# Altium schematic sheet LEDs.SchDoc
size A
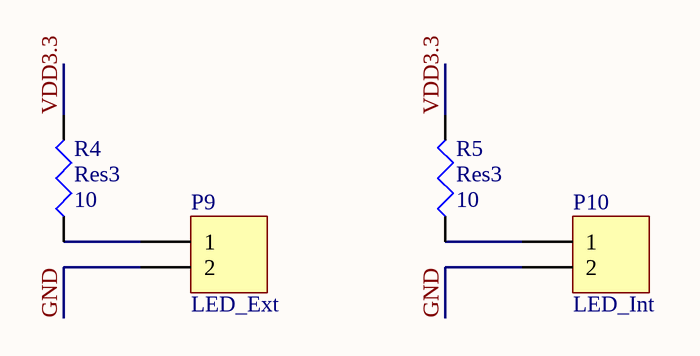
[diagram p0: LEDs.SchDoc]

## Parts
P9  LED_Ext  [HDR1X2]
P10  LED_Int  [HDR1X2]
R4  Res3  value 10  [J1-0603]
R5  Res3  value 10  [J1-0603]

## Nets
GND: P9.2 P10.2
VDD3.3: R4.2 R5.2
NetP9_1: P9.1 R4.1
NetP10_1: P10.1 R5.1

## Library data of the parts
P9 P10 = Header 2: Header, 2-Pin; LatestRevisionDate: 17-Jul-2002; LatestRevisionNote: Re-released for DXP Platform.; Publisher: Altium Limited
R4 R5 = Res3: Resistor; Published: 8-Jun-2000; LatestRevisionDate: 29-May-2009; LatestRevisionNote: IPC-7351 Footprint Added.; PackageReference: J1-0603; Publisher: Altium Limited; PackageDescription: Chip Resistor